# Altium schematic sheet native-custom-power-symbols.SchDoc
size 76 x 45 mm
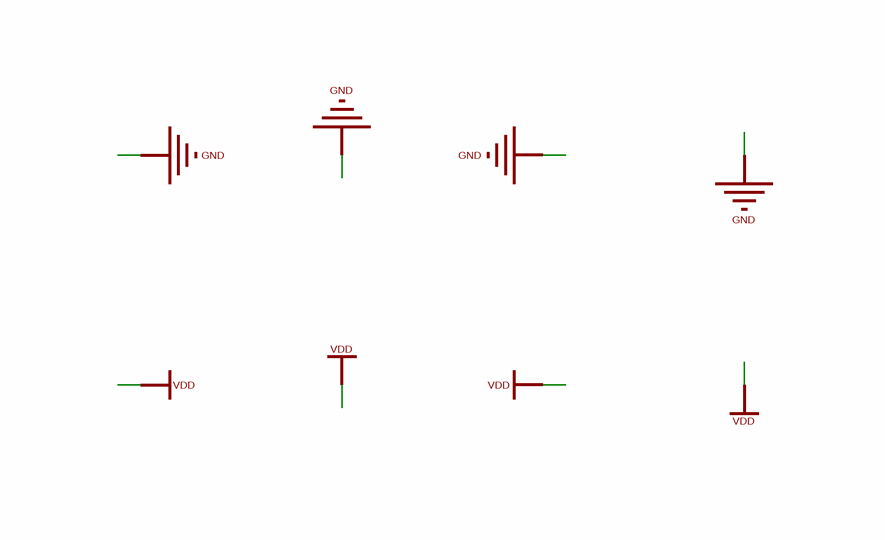
[diagram p0: native-custom-power-symbols.SchDoc]